# EAGLE design MRCS-cpNode-Wemos (EAGLE 7.7.0)
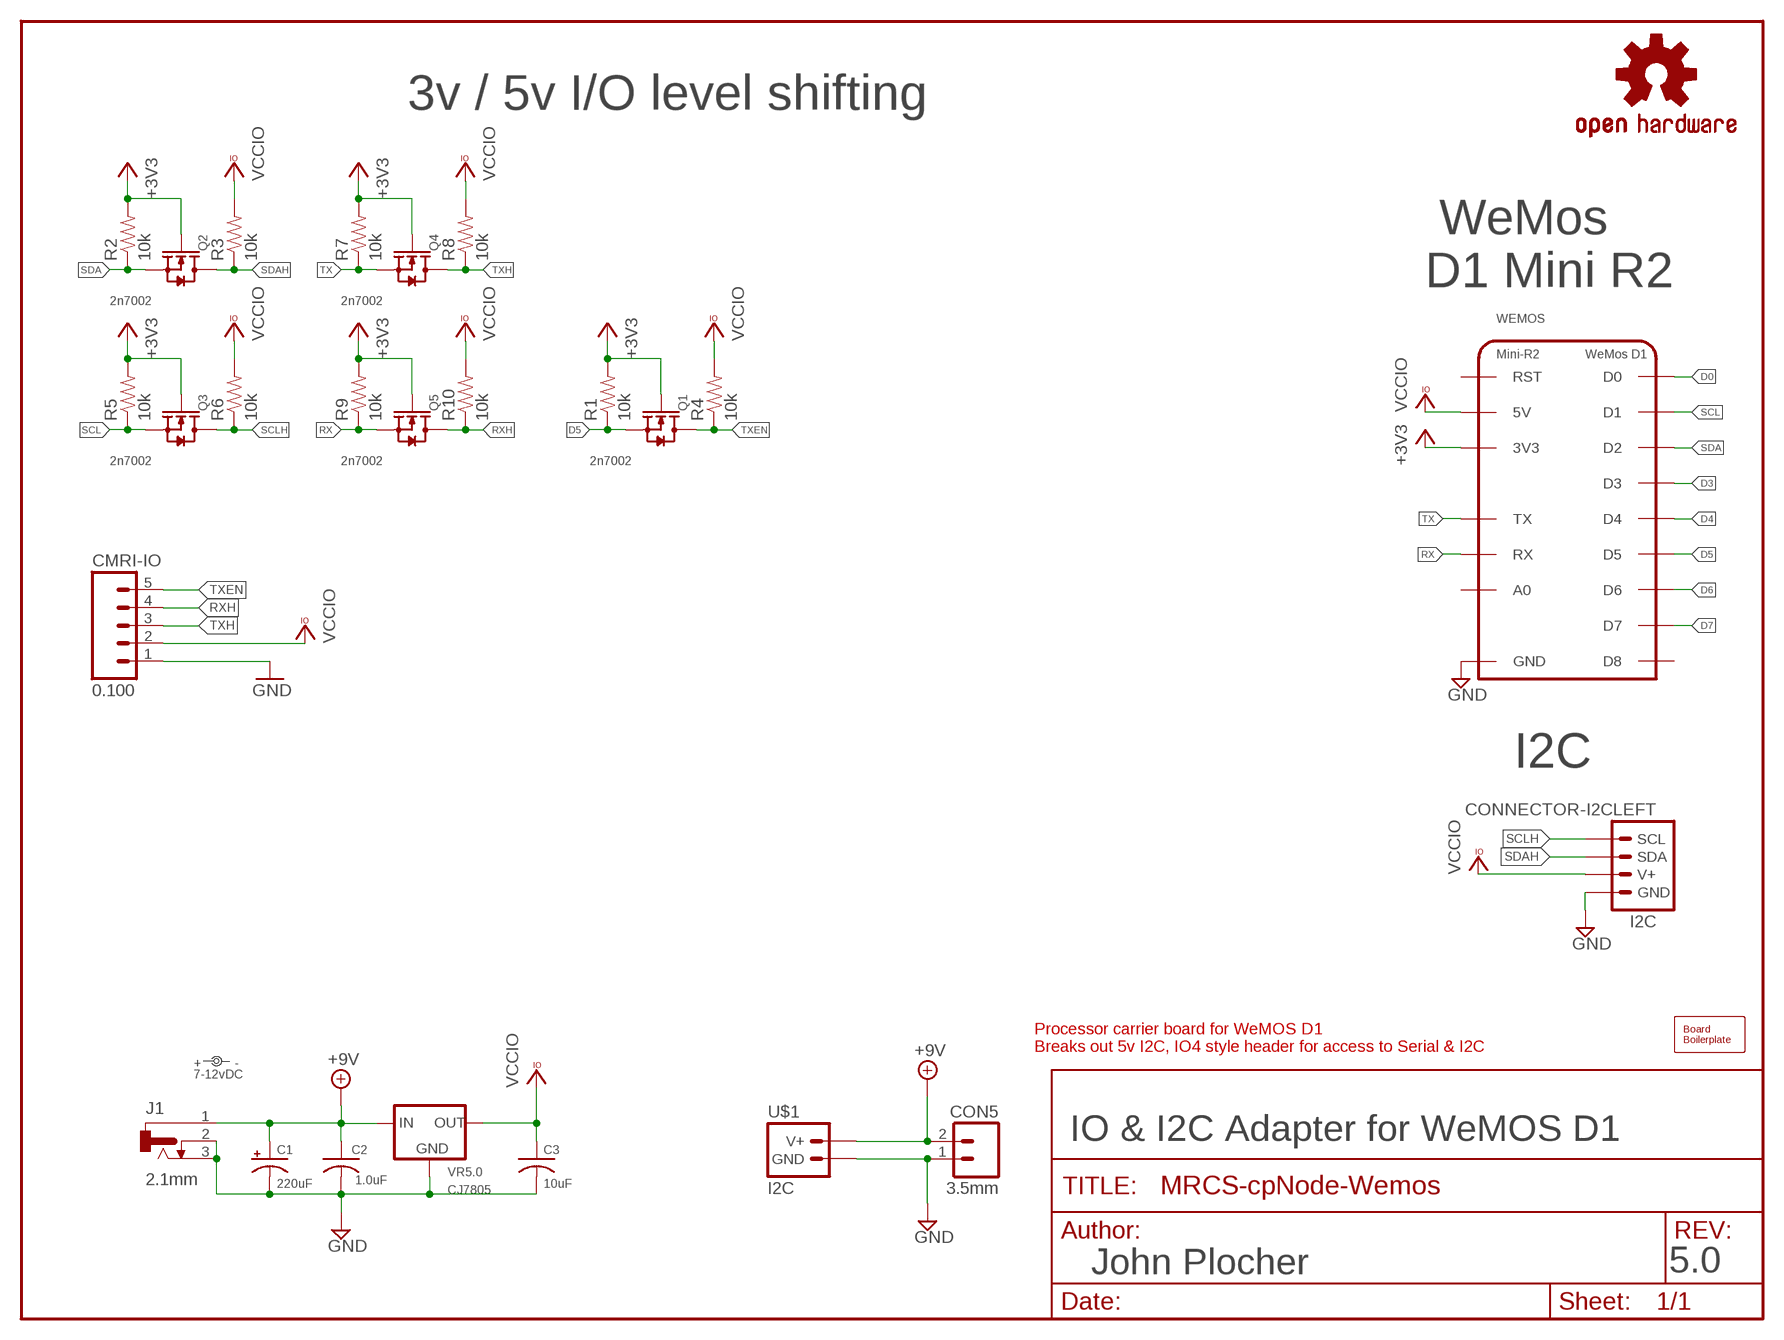
[diagram p0: schematic, sheet 1]

## Parts
BOARD  BOARD  BOARD69X80  [BOARD-DINRAIL-2.7IN-8CM]
C1  220uF  CAP-POL0810  [0810-CAP]
C2  1.0uF  CAP0603  [0603-CAP]
C3  10uF  CAP0603  [0603-CAP]
CMRI-IO  0.100  CONNECTOR-M05LOCK_LONGPADS  [1X05_LOCK_LONGPADS]
CON5  3.5mm  CONNECTOR-M023.5MM-LOCK  [SCREWTERMINAL-3.5MM-2_LOCK]
I2C  CONNECTOR-I2CLEFT  [I2C-L]
J1  2.1mm  CONNECTOR-DC-POWER-RA  [DCJ0202]
LABEL1  7-12vDC  DOC-POWER_LABEL  [PWR_LABEL]
OSHW1  OSHW  OSHW-LOGOL  [OSHW-LOGO-L]
Q1  2n7002  MOSFET-N-BSS138-SOT23  [SOT23]
Q2  2n7002  MOSFET-N-BSS138-SOT23  [SOT23]
Q3  2n7002  MOSFET-N-BSS138-SOT23  [SOT23]
Q4  2n7002  MOSFET-N-BSS138-SOT23  [SOT23]
Q5  2n7002  MOSFET-N-BSS138-SOT23  [SOT23]
R1  10k  R0805-RES  [0805-RES]
R2  10k  R0603-RES  [0603-RES]
R3  10k  R0603-RES  [0603-RES]
R4  10k  R0603-RES  [0603-RES]
R5  10k  R0603-RES  [0603-RES]
R6  10k  R0603-RES  [0603-RES]
R7  10k  R0603-RES  [0603-RES]
R8  10k  R0603-RES  [0603-RES]
R9  10k  R0603-RES  [0603-RES]
R10  10k  R0603-RES  [0603-RES]
U$1  I2C  CONNECTOR-POWER-L  [POWER-R2]
VR5.0  CJ7805  VREG-DPAK-5  [TO-252]
WEMOS  Mini-R2  WEMOS-D1V1  [WEMOS-D1]

## Nets
+3V3: Q1.1(G) Q2.1(G) Q3.1(G) Q4.1(G) Q5.1(G) R1.2 R2.2 R5.2 R7.2 R9.2 WEMOS.3V3
+9V [Feed]: C1.+ C2.1 CON5.2(B) J1.1 U$1.V+ U$1.V+@1(V+) U$1.V+@2(V+) U$1.V+@3(V+) VR5.0.1(IN)
D0 [signals]: WEMOS.D0
D3 [signals]: WEMOS.D3
D4 [signals]: WEMOS.D4
D5 [signals]: Q1.2(S) R1.1 WEMOS.D5
D6 [signals]: WEMOS.D6
D7 [signals]: WEMOS.D7
GND [signals]: C1.- C2.2 C3.2 CMRI-IO.1 CON5.1(A) I2C.GND I2C.GND@1(GND) J1.2 J1.3 U$1.GND U$1.GND@1(GND) U$1.GND@2(GND) U$1.GND@3(GND) VR5.0.2(GND) WEMOS.GND
RX [signals]: Q5.2(S) R9.1 WEMOS.RX
RXH [signals]: CMRI-IO.4 Q5.3(D) R10.1
SCL [signals]: Q3.2(S) R5.1 WEMOS.D1
SCLH [signals]: I2C.SCL I2C.SCL@1(SCL) Q3.3(D) R6.1
SDA [signals]: Q2.2(S) R2.1 WEMOS.D2
SDAH [signals]: I2C.SDA I2C.SDA@1(SDA) Q2.3(D) R3.1
TX [signals]: Q4.2(S) R7.1 WEMOS.TX
TXEN: CMRI-IO.5 Q1.3(D) R4.1
TXH [signals]: CMRI-IO.3 Q4.3(D) R8.1
VCCIO [Power]: C3.1 CMRI-IO.2 I2C.V+ I2C.V+@1(V+) R3.2 R4.2 R6.2 R8.2 R10.2 VR5.0.3(OUT) WEMOS.5V
Unconnected: WEMOS.A0 WEMOS.D8 WEMOS.RST

## Notes on the sheet
- 3v / 5v I/O level shifting
- WeMos
  D1 Mini R2
- I2C
- Processor carrier board for WeMOS D1
  Breaks out 5v I2C, IO4 style header for access to Serial & I2C
- IO & I2C Adapter for WeMOS D1
- John Plocher | 5.0

## Library data of the parts
BOARD = SPCoast:BOARD
C1 = SPCoast:CAP-POL*
C2 C3 = SPCoast:CAP*
CMRI-IO = SPCoast:CONNECTOR-M05: Header 5 Standard 5-pin 0.1" header. Use with straight break away headers (SKU : PRT-00116), right angle break away headers (PRT-00553), swiss pins (PRT-00743), machine pins (PRT-00117), and female headers (PRT-00115). Molex polarized connector foot print use with SKU : PRT-08230 with associated crimp pins and housings.
CON5 = SPCoast:CONNECTOR-M02: PHOENIX CONNECTOR
I2C = SPCoast:CONNECTOR-I2C
J1 = SPCoast:CONNECTOR-DC-POWER: DC POWER JACK
LABEL1 = SPCoast:DOC-POWER_LABEL
OSHW1 = SparkFun:OSHW-LOGO: Open Source Hardware Logo This logo indicates the piece of hardware it is found on incorporates a OSHW license and/or adheres to the definition of open source hardware found here: http://freedomdefined.org/OSHW
Q1-Q5 = SPCoast:MOSFET-N-*-?: CJ2302：SMD MOSFET N-CH 20V-2.1A DMN4468 - SO8 30v/10A
R1-R10 = SPCoast:R*: Resistor Basic schematic elements and footprints for 0603, 1206, and PTH 1/10th watt (small) resistors.
U$1 = SPCoast:CONNECTOR-POWER
VR5.0 = SPCoast:VREG-?-*: Voltage Regulator Standard linear regulator. 7805 uses IGO pinout LM1117 uses GOI pinout
WEMOS = SPCoast:WEMOS-D1

## Net classes
0 default: width 0.254 mm, drill 0.5 mm, clearance 0.203 mm
1 Power: width 0.254 mm, drill 0.5 mm, clearance 0.254 mm
2 signals: width 0.254 mm, drill 0.5 mm, clearance 0.254 mm
3 Feed: width 1.016 mm, drill 1.4 mm, clearance 0.254 mm

## Board
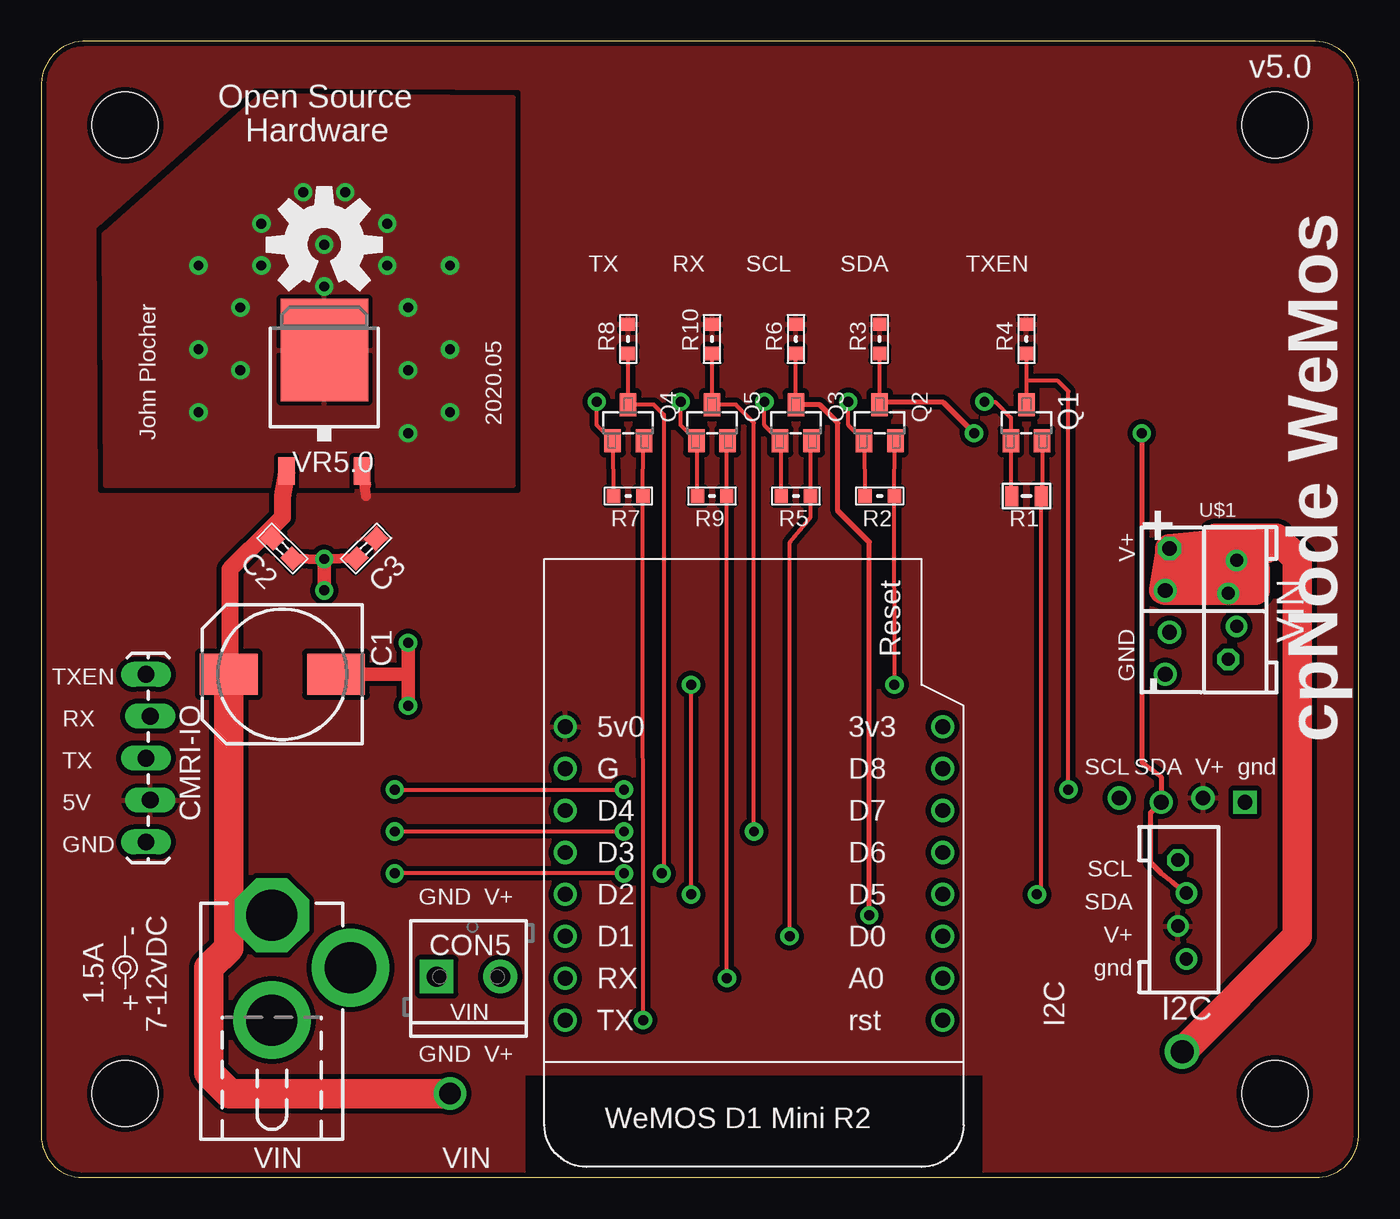
[diagram p1: board, top side]
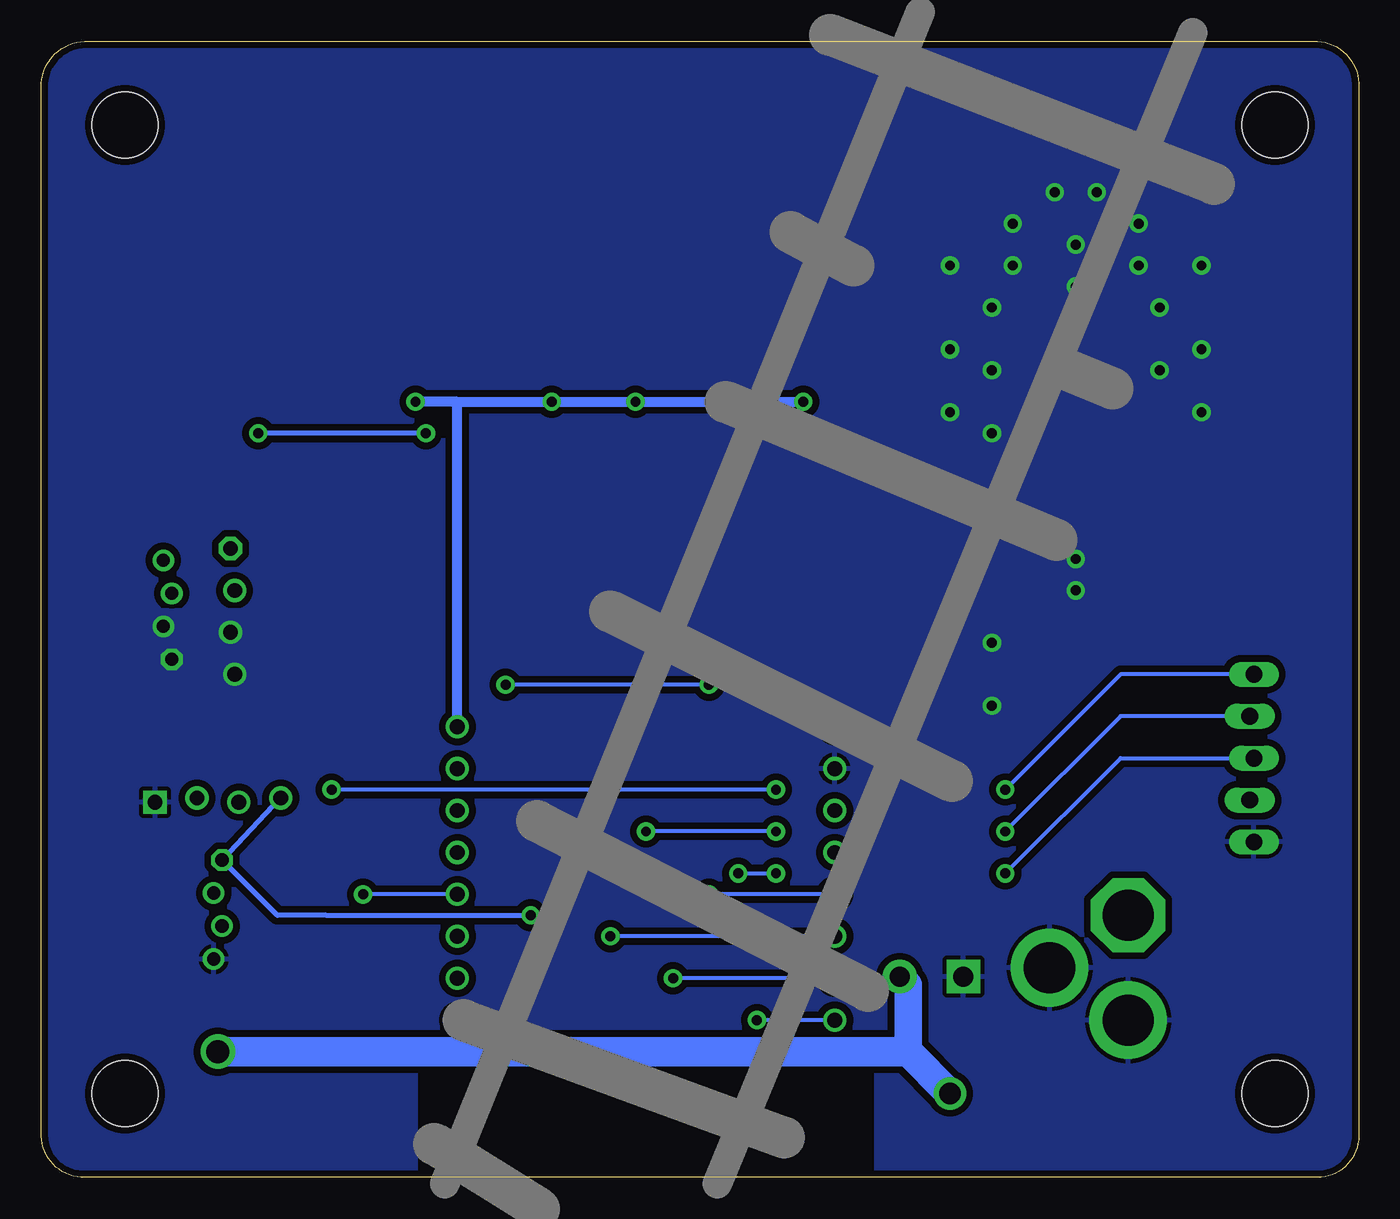
[diagram p2: board, bottom side, seen from below]

Size 79.82 x 68.83 mm. Coordinates in mm from the lower left corner, seen from the top.
Copper layers (1*16): Top 0.035mm / dielectric 1.5mm / Bottom 0.035mm
Design rules "Fusion_eagle_rule_v1.1 *": minimum track width 8mil, minimum drill 0.5mm, track to track 6mil, track to pad 6mil, pad to pad 10mil, via to via 10mil, smd to smd 10mil, copper to edge 10mil, drill to drill 10mil, minimum pad ring 10mil, minimum via ring 10mil, stop-mask expansion 2mil, vias tented up to drill 100mil, thermal gap 10mil

### Footprints (pad centres in the part's own frame; a part is rotated, then mirrored left to right if it is on the bottom)
BOARD-DINRAIL-2.7IN-8CM = hole 4: 74.742,5.08; 5.08,63.754; 74.742,63.754; 5.08,5.08
0810-CAP = smd 3.5 x 2.5: + 3.25,0; - -3.25,0
0603-CAP = smd 1.1 x 1: 1 -0.85,0; 2 0.85,0
1X05_LOCK_LONGPADS = drill 1.016 long: 1 0,0; 2 2.54,-0.254; 3 5.08,0; 4 7.62,-0.254; 5 10.16,0
SCREWTERMINAL-3.5MM-2_LOCK = drill 1.2 pad 2.032 square: 1 -0.178,0 | drill 1.2 pad 2.032: 2 3.678,0
I2C-L = drill 0.9 square: GND 3.81,-0.127 | drill 0.8 pad 1.27: GND@1 0.254,-9.635; SDA@1 0.254,-5.635; V+@1 -0.254,-7.635 | drill 0.9: SCL -3.81,0.127; SDA -1.27,-0.127; V+ 1.27,0.127 | drill 0.8 pad 1.27 octagon: SCL@1 -0.254,-3.635
DCJ0202 = drill 3.1 pad 4.5 octagon: 1 0,3.175 | drill 3.1 pad 4.7: 2 4.763,0; 3 0,-3.175
SOT23 = smd 1.4 x 1: 1 1.1,-0.95; 2 1.1,0.95; 3 -1.1,0
0805-RES = smd 0.8 x 1.2: 1 -0.9,0; 2 0.9,0
0603-RES = smd 0.813 x 0.813: 1 -0.889,0; 2 0.889,0
POWER-R2 = drill 0.9: GND -3.302,-1.27; GND@1 -3.556,-3.81; V+ -3.556,1.27 | drill 0.8 pad 1.27: GND@2 0.762,-0.904; V+@2 0.762,3.096; V+@3 0.254,1.096 | drill 0.8 pad 1.27 octagon: GND@3 0.254,-2.904 | drill 0.9 octagon: V+@1 -3.302,3.81
TO-252 = smd 1.651 x 1.016: 1 -4.826,2.286; 3 -4.826,-2.286 | smd 6.2 x 5.3: 2 2.5,0
WEMOS-D1 = drill 0.9: 3V3 -11.43,-7.62; 5V 11.43,-7.62; A0 -11.43,7.62; D0 -11.43,5.08; D1 11.43,5.08; D2 11.43,2.54; D3 11.43,0; D4 11.43,-2.54; D5 -11.43,2.54; D6 -11.43,0; D7 -11.43,-2.54; D8 -11.43,-5.08; GND 11.43,-5.08; RST -11.43,10.16; RX 11.43,7.62; TX 11.43,10.16

### Placement (x,y rotation side)
BOARD  0,0 0 top
C1  14.61,30.48 180 top
C2  14.61,38.1 315 top
C3  19.69,38.1 225 top
CMRI-IO  6.35,20.32 90 top
CON5  24.13,12.16 0 top
I2C  69.12,22.86 0 top
J1  13.97,12.7 0 top
LABEL1  5.08,12.7 180 top
OSHW1  17.15,56.52 0 top
Q1  59.69,45.72 270 top
Q2  50.8,45.72 270 top
Q3  45.72,45.72 270 top
Q4  35.56,45.72 270 top
Q5  40.64,45.72 270 top
R1  59.69,41.27 180 top
R2  50.8,41.27 180 top
R3  50.8,50.8 90 top
R4  59.69,50.8 90 top
R5  45.72,41.27 180 top
R6  45.72,50.8 90 top
R7  35.56,41.27 180 top
R8  35.56,50.8 90 top
R9  40.64,41.27 180 top
R10  40.64,50.8 90 top
U$1  71.66,34.29 0 top
VR5.0  17.15,47.62 90 top
WEMOS  43.18,19.68 180 top

### Tracks (layer width: path | path; a pad name or v marks a point on that pad's centre or on a via)
+3V3  (via drill 0.6)
  Top 0.254: R7.2 34.66,44.57 Q4.1 33.66,45.58 v33.66,46.99 | R9.2 39.74,44.57 Q5.1 38.74,45.58 v38.74,46.99 | R2.2 49.9,44.57 Q2.1 48.9,45.58 v48.9,46.99 | R5.2 44.82,44.57 Q3.1 43.82,45.58 v43.82,46.99 | R1.2 58.74,41.96 Q1.1 58.74,46.03 57.79,46.99 v57.15,46.99
  Bottom 0.61: v33.66,46.99 v38.74,46.99 v43.82,46.99 v48.9,46.99 54.61,46.99 | WEMOS.3V3 54.61,46.99 | 54.61,46.99 v57.15,46.99
+9V  (via drill 1.3, 1.4)
  Top 0.305: 71.16,38.73 71.16,38.36
  Top 1.016: VR5.0.1 14.61,41.27 14.61,40.01 13.97,39.37 | 13.97,39.37 11.43,36.83 11.43,30.55 C1.+ | C2.1 13.97,38.73 13.97,39.37
  Top 1.27: 11.43,30.48 C1.+
  Top 1.422: U$1.V+ 70.82,35.39 U$1.V+@3 71.92,37.39 U$1.V+@2 71.03,37.39 71.03,35.56 70.9,35.56
  Top 1.676: U$1.V+@1 67.95,35.56
  Top 1.778: C1.+ 11.36,15.88 | v69.12,7.62 76.11,14.61 76.11,37.47 74.84,38.73 71.16,38.73 | 70.9,35.56 U$1.V+@1 71.16,38.36 | 11.36,15.88 J1.1 | 11.36,15.88 11.36,13.89 10.16,12.7 10.16,6.35 11.43,5.08 v24.77,5.08 | 74.2,38.1 72.3,38.1 72.3,36.83 73.57,36.83 73.57,35.56 U$1.V+
  Bottom 1.676: 27.31,7.62 27.31,11.66 CON5.2
  Bottom 1.778: v69.12,7.62 27.31,7.62 v24.77,5.08
D5  (via drill 0.6)
  Top 0.254: Q1.2 60.64,41.96 R1.1 60.59,17.41 v60.33,17.14
  Bottom 0.254: WEMOS.D5 v60.33,17.14
GND  (via drill 0.6)
  Top 0.61: C2.2 v17.15,37.46 | C3.2 v17.15,37.46 | v17.15,37.46 | v17.15,37.47 v17.15,37.46
  Top 0.813: C1.- 22.23,30.48 | 22.23,30.48 v22.23,32.38 | v22.23,28.57 22.23,30.48 | v17.15,35.56 v17.15,37.47
  other vias: 22.23,45.09 22.23,48.9 22.23,52.7 12.07,48.9 12.07,52.7 17.15,53.98 20.96,57.78 13.34,57.78 15.88,59.69 24.77,50.16 9.53,50.16 24.77,46.35 9.53,55.24 24.77,55.24 18.42,59.69 13.34,55.24 20.96,55.24 17.15,56.52 9.53,46.35
  pour Bottom (isolate 0.406, rank 2): 81.28,0 81.28,68.58 0,68.58 0,0 29.21,0 29.21,6.35 57.15,6.35 57.15,0
  pour Top (isolate 0): 13.29,65.56 28.58,65.44 28.58,41.91 3.9,41.91 3.81,57.15 3.9,57.23
  pour Bottom (no thermals): 66.68,34.29 73.66,34.29 73.66,29.21 66.68,29.21
RX  (via drill 0.6)
  Top 0.254: Q5.2 41.54,44.57 R9.1 v41.54,12.06
  Bottom 0.254: WEMOS.RX v41.54,12.06
RXH  (via drill 0.6)
  Top 0.254: R10.1 Q5.3 42.08,46.82 43.18,45.72 v43.18,20.95 | v21.42,20.95 v35.31,20.95
  Bottom 0.254: CMRI-IO.4 14.43,27.94 v21.42,20.95 | v35.31,20.95 v43.18,20.95
SCL  (via drill 0.6)
  Top 0.254: Q3.2 46.62,44.57 R5.1 46.61,40.01 45.35,38.47 v45.34,14.61
  Bottom 0.254: WEMOS.D1 v45.34,14.61
SCLH  (via drill 0.6)
  Top 0.254: Q3.3 R6.1
  Top 0.305: v50.17,15.88 50.17,38.48 48.26,40.39 48.26,45.72 47.16,46.82 Q3.3
  Bottom 0.305: I2C.SCL I2C.SCL@1 65.52,15.88 62.54,15.88 v50.17,15.88
SDA  (via drill 0.6)
  Top 0.254: Q2.2 51.7,44.57 R2.1 51.7,30.11 v51.69,29.84 | v39.37,17.14 v39.37,29.84
  Bottom 0.254: WEMOS.D2 v39.37,17.14 | v39.37,29.84 v51.69,29.84
SDAH  (via drill 0.6)
  Top 0.254: Q2.3 R3.1
  Top 0.305: I2C.SDA@1 68.56,17.87 67.85,18.41 67.22,19.05 67.22,22.1 I2C.SDA 67.85,24.26 66.68,25.15 v66.68,45.09 | Q2.3 50.97,46.99 54.61,46.99 v56.52,45.09
  Bottom 0.305: v56.52,45.09 v66.68,45.09
TX  (via drill 0.6)
  Top 0.254: Q4.2 36.46,44.57 R7.1 v36.46,9.53
  Bottom 0.254: WEMOS.TX v36.46,9.53
TXEN  (via drill 0.6)
  Top 0.254: R4.1 59.69,48.26 | 59.69,48.26 Q1.3 | v21.42,23.5 v35.31,23.5 | v62.23,23.5 62.23,47.62 61.6,48.26 59.69,48.26
  Bottom 0.254: CMRI-IO.5 14.43,30.48 v21.42,23.5 | v35.31,23.5 v62.23,23.5
TXH  (via drill 0.6)
  Top 0.254: R8.1 Q4.3 37.11,46.82 37.72,46.21 37.72,18.92 v37.59,18.41 | v35.31,18.41 v21.42,18.41
  Bottom 0.254: v21.42,18.41 14.43,25.4 CMRI-IO.3 | v37.59,18.41 v35.31,18.41
VCCIO
  Top 0.61: 19.69,41.91 VR5.0.3 19.69,41.27
  pour Top (isolate 0.305, rank 2): 81.28,0 81.28,68.58 0,68.58 0,0 29.21,0 29.21,6.35 57.15,6.35 57.15,0

### Text on the board
tPlace: v5.0 | Open Source | Hardware | TX | RX | SCL | SDA | TXEN | 2020.05 | John Plocher | + | TXEN | - | RX | cpNode WeMos | TX | 5V | GND | GND V+ | 1.5A | VIN | GND V+ | WeMOS D1 Mini R2 | VIN | VIN
bDocu: cpNode WeMOS D1 Mini | Go Bears! | I2C master and CMRI Node | For use with WeMOS D1 ESP8266 | Model Railroading is fun! | Made in the PCR, Coast Division, NMRA | www. SP Coast .com